# Altium schematic sheet Sheet3.SchDoc
size 839 x 594 mm; SheetNumber: 3; SheetTotal: 3
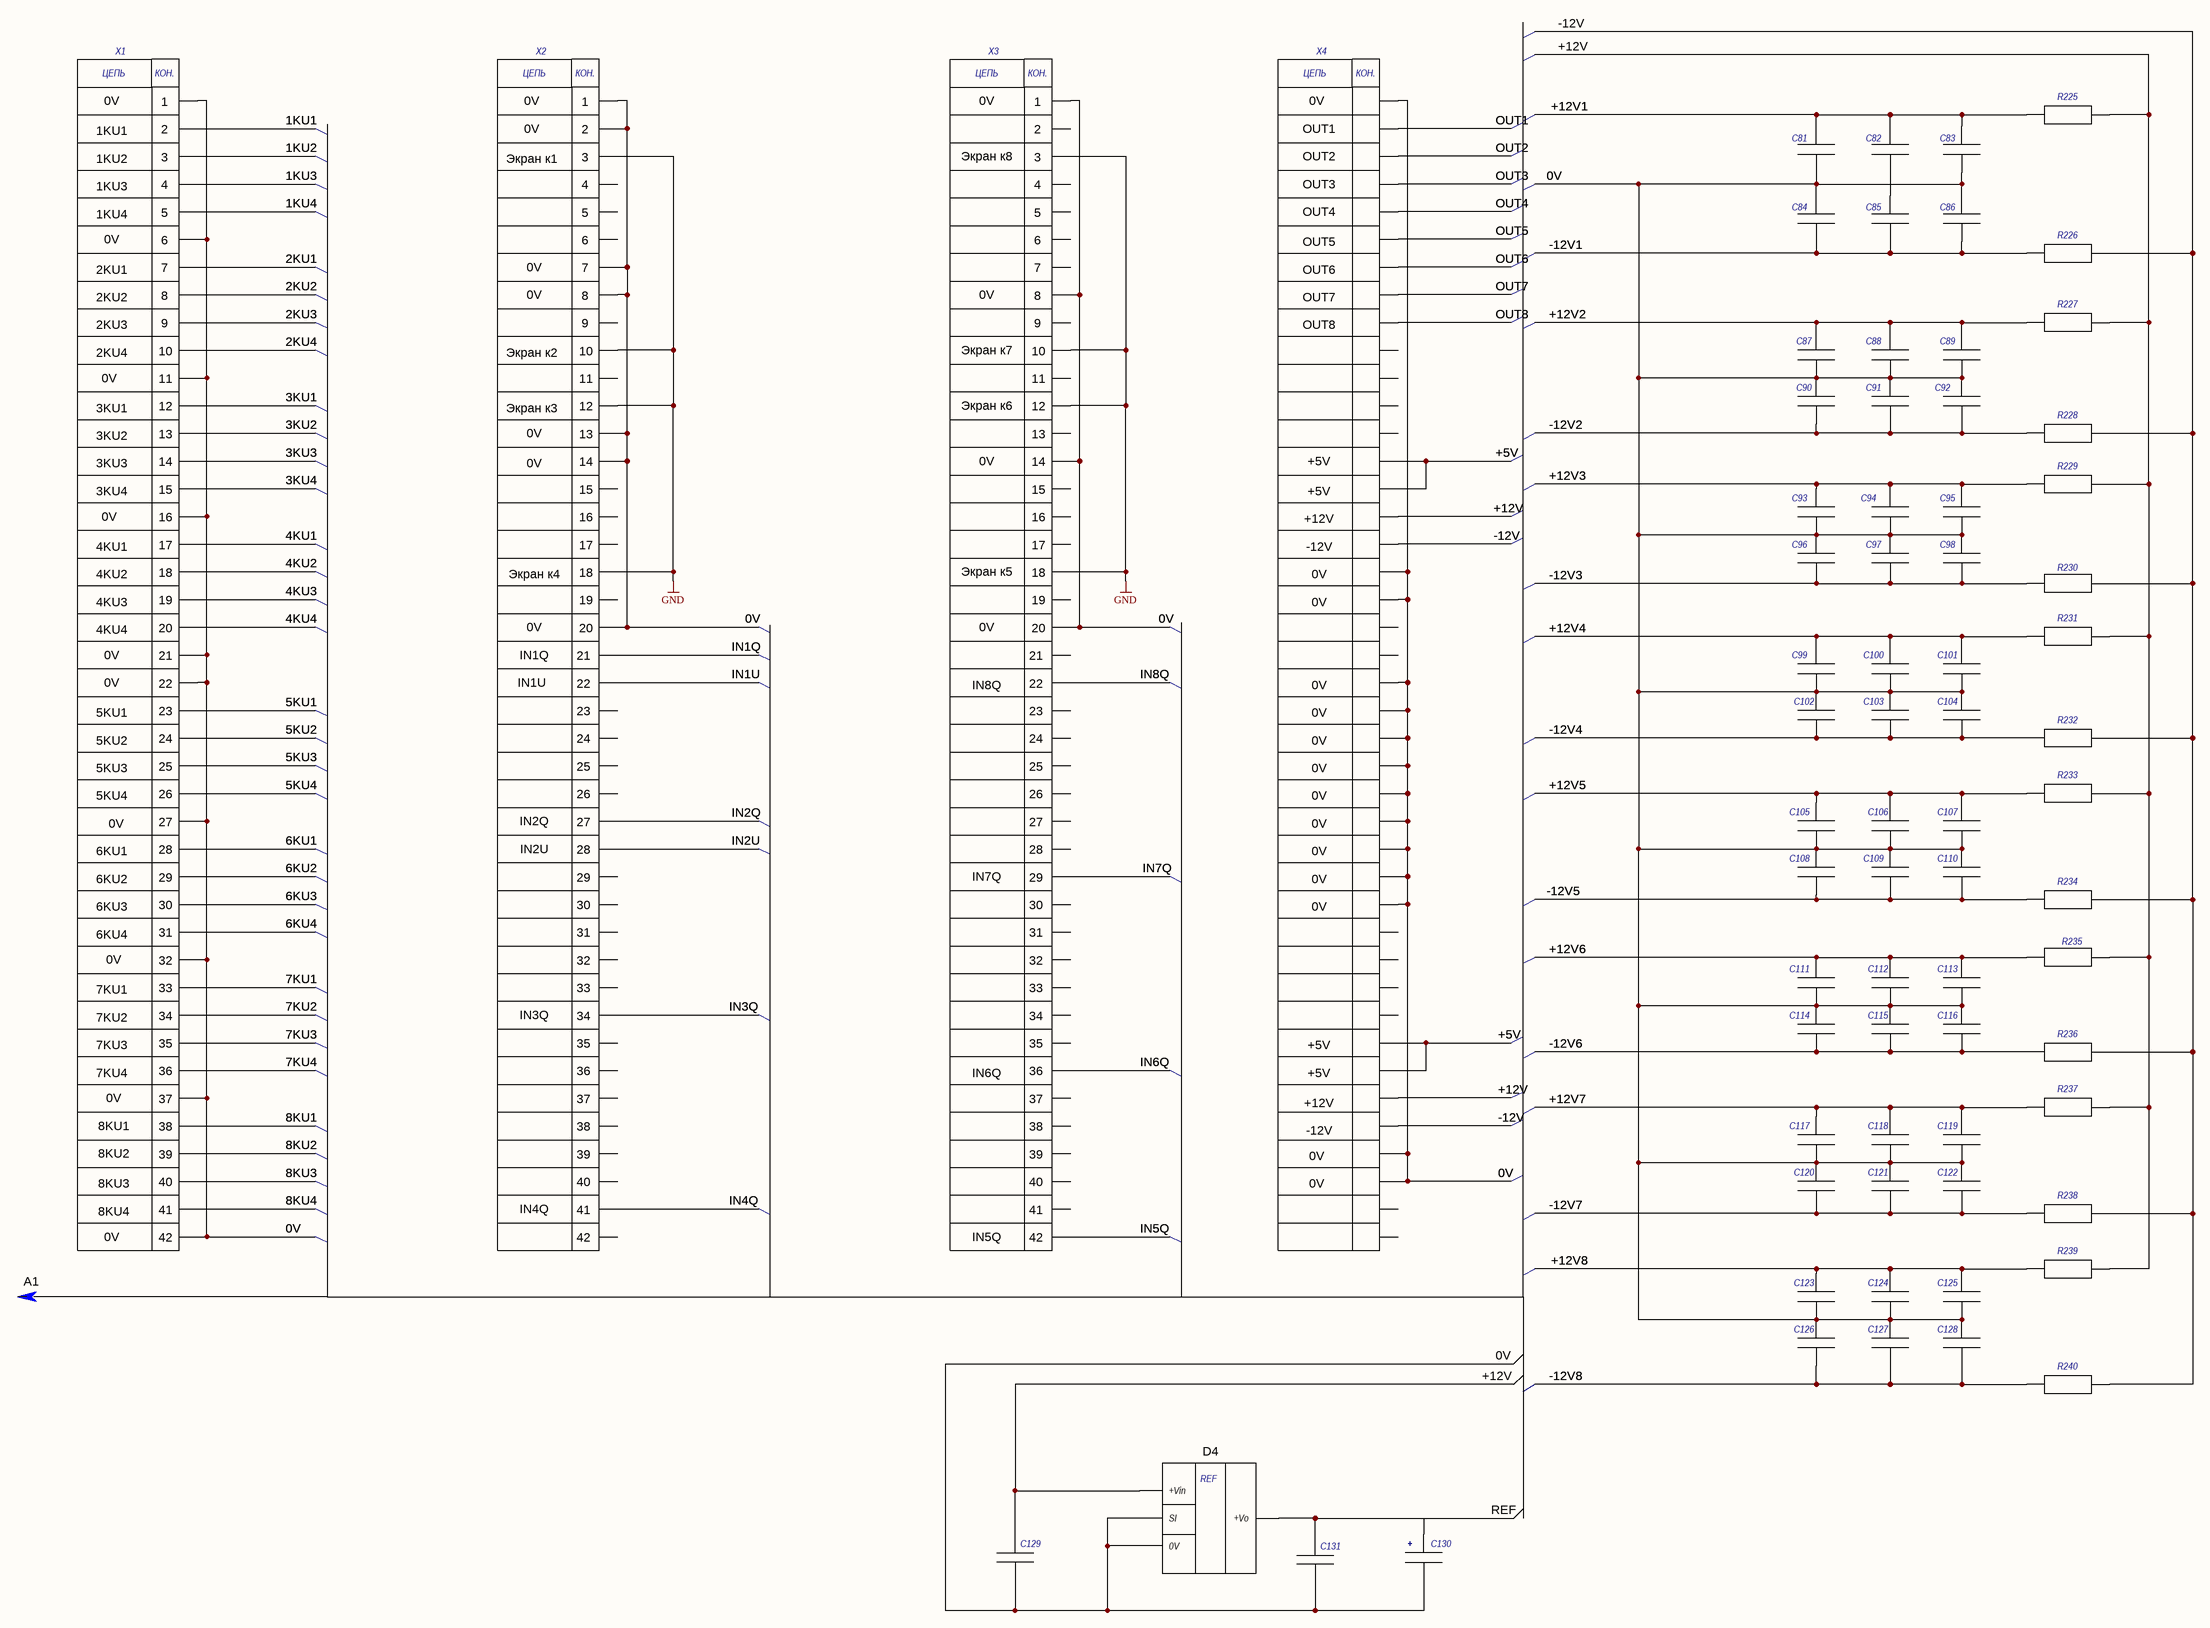
[diagram p0: Sheet3.SchDoc]

## Parts
?  PWR_ARROW  (value not drawn)  (graphical)
C81  C_0603  [C_0603]  (value not drawn)
C82  C_0603  [C_0603]  (value not drawn)
C83  C_0603  [C_0603]  (value not drawn)
C84  C_0603  [C_0603]  (value not drawn)
C85  C_0603  [C_0603]  (value not drawn)
C86  C_0603  [C_0603]  (value not drawn)
C87  C_0603  [C_0603]  (value not drawn)
C88  C_0603  [C_0603]  (value not drawn)
C89  C_0603  [C_0603]  (value not drawn)
C90  C_0603  [C_0603]  (value not drawn)
C91  C_0603  [C_0603]  (value not drawn)
C92  C_0603  [C_0603]  (value not drawn)
C93  C_0603  [C_0603]  (value not drawn)
C94  C_0603  [C_0603]  (value not drawn)
C95  C_0603  [C_0603]  (value not drawn)
C96  C_0603  [C_0603]  (value not drawn)
C97  C_0603  [C_0603]  (value not drawn)
C98  C_0603  [C_0603]  (value not drawn)
C99  C_0603  [C_0603]  (value not drawn)
C100  C_0603  [C_0603]  (value not drawn)
C101  C_0603  [C_0603]  (value not drawn)
C102  C_0603  [C_0603]  (value not drawn)
C103  C_0603  [C_0603]  (value not drawn)
C104  C_0603  [C_0603]  (value not drawn)
C105  C_0603  [C_0603]  (value not drawn)
C106  C_0603  [C_0603]  (value not drawn)
C107  C_0603  [C_0603]  (value not drawn)
C108  C_0603  [C_0603]  (value not drawn)
C109  C_0603  [C_0603]  (value not drawn)
C110  C_0603  [C_0603]  (value not drawn)
C111  C_0603  [C_0603]  (value not drawn)
C112  C_0603  [C_0603]  (value not drawn)
C113  C_0603  [C_0603]  (value not drawn)
C114  C_0603  [C_0603]  (value not drawn)
C115  C_0603  [C_0603]  (value not drawn)
C116  C_0603  [C_0603]  (value not drawn)
C117  C_0603  [C_0603]  (value not drawn)
C118  C_0603  [C_0603]  (value not drawn)
C119  C_0603  [C_0603]  (value not drawn)
C120  C_0603  [C_0603]  (value not drawn)
C121  C_0603  [C_0603]  (value not drawn)
C122  C_0603  [C_0603]  (value not drawn)
C123  C_0603  [C_0603]  (value not drawn)
C124  C_0603  [C_0603]  (value not drawn)
C125  C_0603  [C_0603]  (value not drawn)
C126  C_0603  [C_0603]  (value not drawn)
C127  C_0603  [C_0603]  (value not drawn)
C128  C_0603  [C_0603]  (value not drawn)
C129  C_0603  [C_0603]  (value not drawn)
C130  C_3216  [C_3216]  (value not drawn)
C131  C_0603  [C_0603]  (value not drawn)
R225  R_0603  [R_0603]  (value not drawn)
R226  R_0603  [R_0603]  (value not drawn)
R227  R_0603  [R_0603]  (value not drawn)
R228  R_0603  [R_0603]  (value not drawn)
R229  R_0603  [R_0603]  (value not drawn)
R230  R_0603  [R_0603]  (value not drawn)
R231  R_0603  [R_0603]  (value not drawn)
R232  R_0603  [R_0603]  (value not drawn)
R233  R_0603  [R_0603]  (value not drawn)
R234  R_0603  [R_0603]  (value not drawn)
R235  R_0603  [R_0603]  (value not drawn)
R236  R_0603  [R_0603]  (value not drawn)
R237  R_0603  [R_0603]  (value not drawn)
R238  R_0603  [R_0603]  (value not drawn)
R239  R_0603  [R_0603]  (value not drawn)
R240  R_0603  [R_0603]  (value not drawn)
U1  AD780AR  (value not drawn)
X1  X_ONPZI-8-42  [X_ONP-JI]  (value not drawn)
X2  X_ONPZI-8-42  [X_ONP-JI]  (value not drawn)
X3  X_ONPZI-8-42  [X_ONP-JI]  (value not drawn)
X4  X_ONPZI-8-42  [X_ONP-JI]  (value not drawn)

## Nets
GND: X2.3 X2.10 X2.12 X2.18 X3.3 X3.10 X3.12 X3.18
0V: C81.2 C83.2 C84.1 C86.1 C87.2 C88.2 C89.2 C90.1 C91.1 C92.1 C93.2 C94.2 C95.2 C96.1 C97.1 C98.1 C99.2 C100.2 C101.2 C102.1 C103.1 C104.1 C105.2 C106.2 C107.2 C108.1 C109.1 C110.1 C111.2 C112.2 C113.2 C114.1 C115.1 C116.1 C117.2 C118.2 C119.2 C120.1 C121.1 C122.1 C123.2 C124.2 C125.2 C126.1 C127.1 C128.1 C129.2 C130.2 C131.2 U1.4(0V) U1.8(SI) X1.1 X1.6 X1.11 X1.16 X1.21 X1.22 X1.27 X1.32 X1.37 X1.42 X2.1 X2.2 X2.7 X2.8 X2.13 X2.14 X2.20 X3.1 X3.8 X3.14 X3.20 X4.1 X4.18 X4.19 X4.22 X4.23 X4.24 X4.25 X4.26 X4.27 X4.28 X4.29 X4.30 X4.39 X4.40
1KU1: X1.2
1KU2: X1.3
1KU3: X1.4
1KU4: X1.5
2KU1: X1.7
2KU2: X1.8
2KU3: X1.9
2KU4: X1.10
3KU1: X1.12
3KU2: X1.13
3KU3: X1.14
3KU4: X1.15
4KU1: X1.17
4KU2: X1.18
4KU3: X1.19
4KU4: X1.20
5KU1: X1.23
5KU2: X1.24
5KU3: X1.25
5KU4: X1.26
6KU1: X1.28
6KU2: X1.29
6KU3: X1.30
6KU4: X1.31
7KU1: X1.33
7KU2: X1.34
7KU3: X1.35
7KU4: X1.36
8KU1: X1.38
8KU2: X1.39
8KU3: X1.40
8KU4: X1.41
+5V: X4.14 X4.15 X4.35 X4.36
+12V: C129.1 R225.2 R227.2 R229.2 R231.2 R233.2 R235.2 R237.2 R239.2 U1.1(+Vin) X4.16 X4.37
+12V1: C81.1 C82.1 C83.1 R225.1
+12V2: C87.1 C88.1 C89.1 R227.1
+12V3: C93.1 C94.1 C95.1 R229.1
+12V4: C99.1 C100.1 C101.1 R231.1
+12V5: C105.1 C106.1 C107.1 R233.1
+12V6: C111.1 C112.1 C113.1 R235.1
+12V7: C117.1 C118.1 C119.1 R237.1
+12V8: C123.1 C124.1 C125.1 R239.1
-12V: R226.2 R228.2 R230.2 R232.2 R234.2 R236.2 R238.2 R240.2 X4.17 X4.38
-12V1: C84.2 C85.2 C86.2 R226.1
-12V2: C90.2 C91.2 C92.2 R228.1
-12V3: C96.2 C97.2 C98.2 R230.1
-12V4: C102.2 C103.2 C104.2 R232.1
-12V5: C108.2 C109.2 C110.2 R234.1
-12V6: C114.2 C115.2 C116.2 R236.1
-12V7: C120.2 C121.2 C122.2 R238.1
-12V8: C126.2 C127.2 C128.2 R240.1
IN1Q: X2.21
IN1U: X2.22
IN2Q: X2.27
IN2U: X2.28
IN3Q: X2.34
IN4Q: X2.41
IN5Q: X3.42
IN6Q: X3.36
IN7Q: X3.29
IN8Q: X3.22
OUT1: X4.2
OUT2: X4.3
OUT3: X4.4
OUT4: X4.5
OUT5: X4.6
OUT6: X4.7
OUT7: X4.8
OUT8: X4.9
REF: C130.1 C131.1 U1.6(+Vo)
NetC82_2: C82.2 C85.1

Not connected (* = marked no-connect by the designer): ? 1; X2 4 5 6 9 11 15 16 17 19 23 24 25 26 29 30 31 32 33 35 36 37 38 39 40 42; X3 2 4 5 6 7 9 11 13 15 16 17 19 21 23 24 25 26 27 28 30 31 32 33 34 35 37 38 39 40 41; X4 10 11 12 13 20 21 31 32 33 34 41 42

## Notes on the sheet
- 0V
- 1KU2
- 1KU1
- (near X1) 2
- (near X1) 1
- (near X2) Экран к1
- (near X2) 2
- (near X2) 1
- (near X3) Экран к8
- (near X3) 2
- (near X3) 1
- OUT2
- OUT1
- 1KU3
- 1KU4
- (near X1) 4
- (near X1) 3
- (near X2) 4
- (near X2) 3
- (near X3) 4
- (near X3) 3
- OUT3
- OUT4
- 2KU1
- (near X1) 5
- (near X1) 6
- (near X1) 7
- (near X2) 5
- (near X2) 6
- (near X2) 7
- (near X3) 5
- (near X3) 6
- (near X3) 7
- OUT5
- OUT6
- 2KU3
- 2KU2
- (near X1) 9
- (near X1) 8
- (near X2) 9
- (near X2) 8
- (near X3) 9
- (near X3) 8
- OUT8
- OUT7
- 2KU4
- (near X1) 10
- (near X1) 11
- (near X2) Экран к2
- (near X2) 10
- (near X2) 11
- (near X3) Экран к7
- (near X3) 10
- (near X3) 11
- 3KU2
- 3KU1
- (near X1) 13
- (near X1) 12
- (near X2) Экран к3
- (near X2) 13
- (near X2) 12
- (near X3) Экран к6
- (near X3) 13
- (near X3) 12
- 3KU3
- 3KU4
- (near X1) 14
- (near X1) 15
- (near X2) 14
- (near X2) 15
- (near X3) 14
- (near X3) 15
- +5V
- 4KU1
- (near X1) 17
- (near X1) 16
- (near X2) 17
- (near X2) 16
- (near X3) 17
- (near X3) 16
- -12V
- +12V
- 4KU2
- 4KU3
- 4KU4
- (near X1) 18
- (near X1) 19
- (near X2) Экран к4
- (near X2) 18
- (near X2) 19
- (near X3) Экран к5
- (near X3) 18
- (near X3) 19
- (near X1) 21
- (near X1) 20
- IN1U
- IN1Q
- (near X2) 21
- (near X2) 20
- IN8Q
- (near X3) 21
- (near X3) 20
- 5KU1
- 5KU2
- (near X1) 23
- (near X1) 22
- (near X2) 23
- (near X2) 22
- (near X3) 23
- (near X3) 22
- 5KU3
- 5KU4
- (near X1) 26
- (near X1) 24
- (near X1) 25
- (near X2) 26
- (near X2) 24
- (near X2) 25
- (near X3) 26
- (near X3) 24
- (near X3) 25
- 6KU1
- (near X1) 27
- (near X1) 28
- IN2Q
- IN2U
- (near X2) 27
- (near X2) 28
- (near X3) 27
- (near X3) 28
- 6KU2
- 6KU3
- (near X1) 29
- (near X1) 30
- (near X2) 29
- (near X2) 30
- IN7Q
- (near X3) 29
- (near X3) 30
- 6KU4
- (near X1) 32
- (near X1) 31
- (near X2) 32
- (near X2) 31
- (near X3) 32
- (near X3) 31
- 7KU1
- 7KU2
- (near X1) 33
- (near X1) 34
- IN3Q
- (near X2) 33
- (near X2) 34
- (near X3) 33
- (near X3) 34
- 7KU4
- 7KU3
- (near X1) 36
- (near X1) 35
- (near X2) 36
- (near X2) 35
- IN6Q
- (near X3) 36
- (near X3) 35
- 8KU1
- 8KU2
- (near X1) 37
- (near X1) 38
- (near X2) 37
- (near X2) 38
- (near X3) 37
- (near X3) 38
- 8KU4
- 8KU3
- (near X1) 40
- (near X1) 39
- IN4Q
- (near X2) 40
- (near X2) 39
- (near X3) 40
- (near X3) 39
- (near X1) 42
- (near X1) 41
- (near X2) 42
- (near X2) 41
- IN5Q
- (near X3) 42
- (near X3) 41
- (near ?) A1
- (near U1) D4
- Подп. и дата
- Инв.№ дубл.
- Взам.инв.№
- Подп.и дата
- Инв.№ подл.
- Изм.
- Лист
- № докум.
- Подп.
- Дата
- Формат  A1
- (in symbol AD780AR) REF
- (in symbol C_3216) +
- (in symbol X_ONPZI-8-42) ЦЕПЬ; КОН.

## Library data of the parts
C81-C129 C131 = C_0603: 0805; Value: 0,033; Mark: 0,01
C130 = C_3216: Value: 1; Mark: {Mark}
R225-R240 = R_0603: Value: 10
U1 = AD780AR: Value: *